# EasyEDA Pro project Keithley 2000 SCAN Panasonic DB25 V1.0.epro

# Schematic Keithley 2000 SCAN Panasonic DB25 V1.0
Board Name: Keithley 2000 SCAN Panasonic DB25 V1.0; Create Date: 2026-03-20; Page Name: Main; Project Name: SCAN2000; Schematic Name: Keithley 2000 SCAN Panasonic DB25 V1.0; Update Date: 2026-03-20; Company: EasyEDA.com; Page Size: A4; Version: V1.0
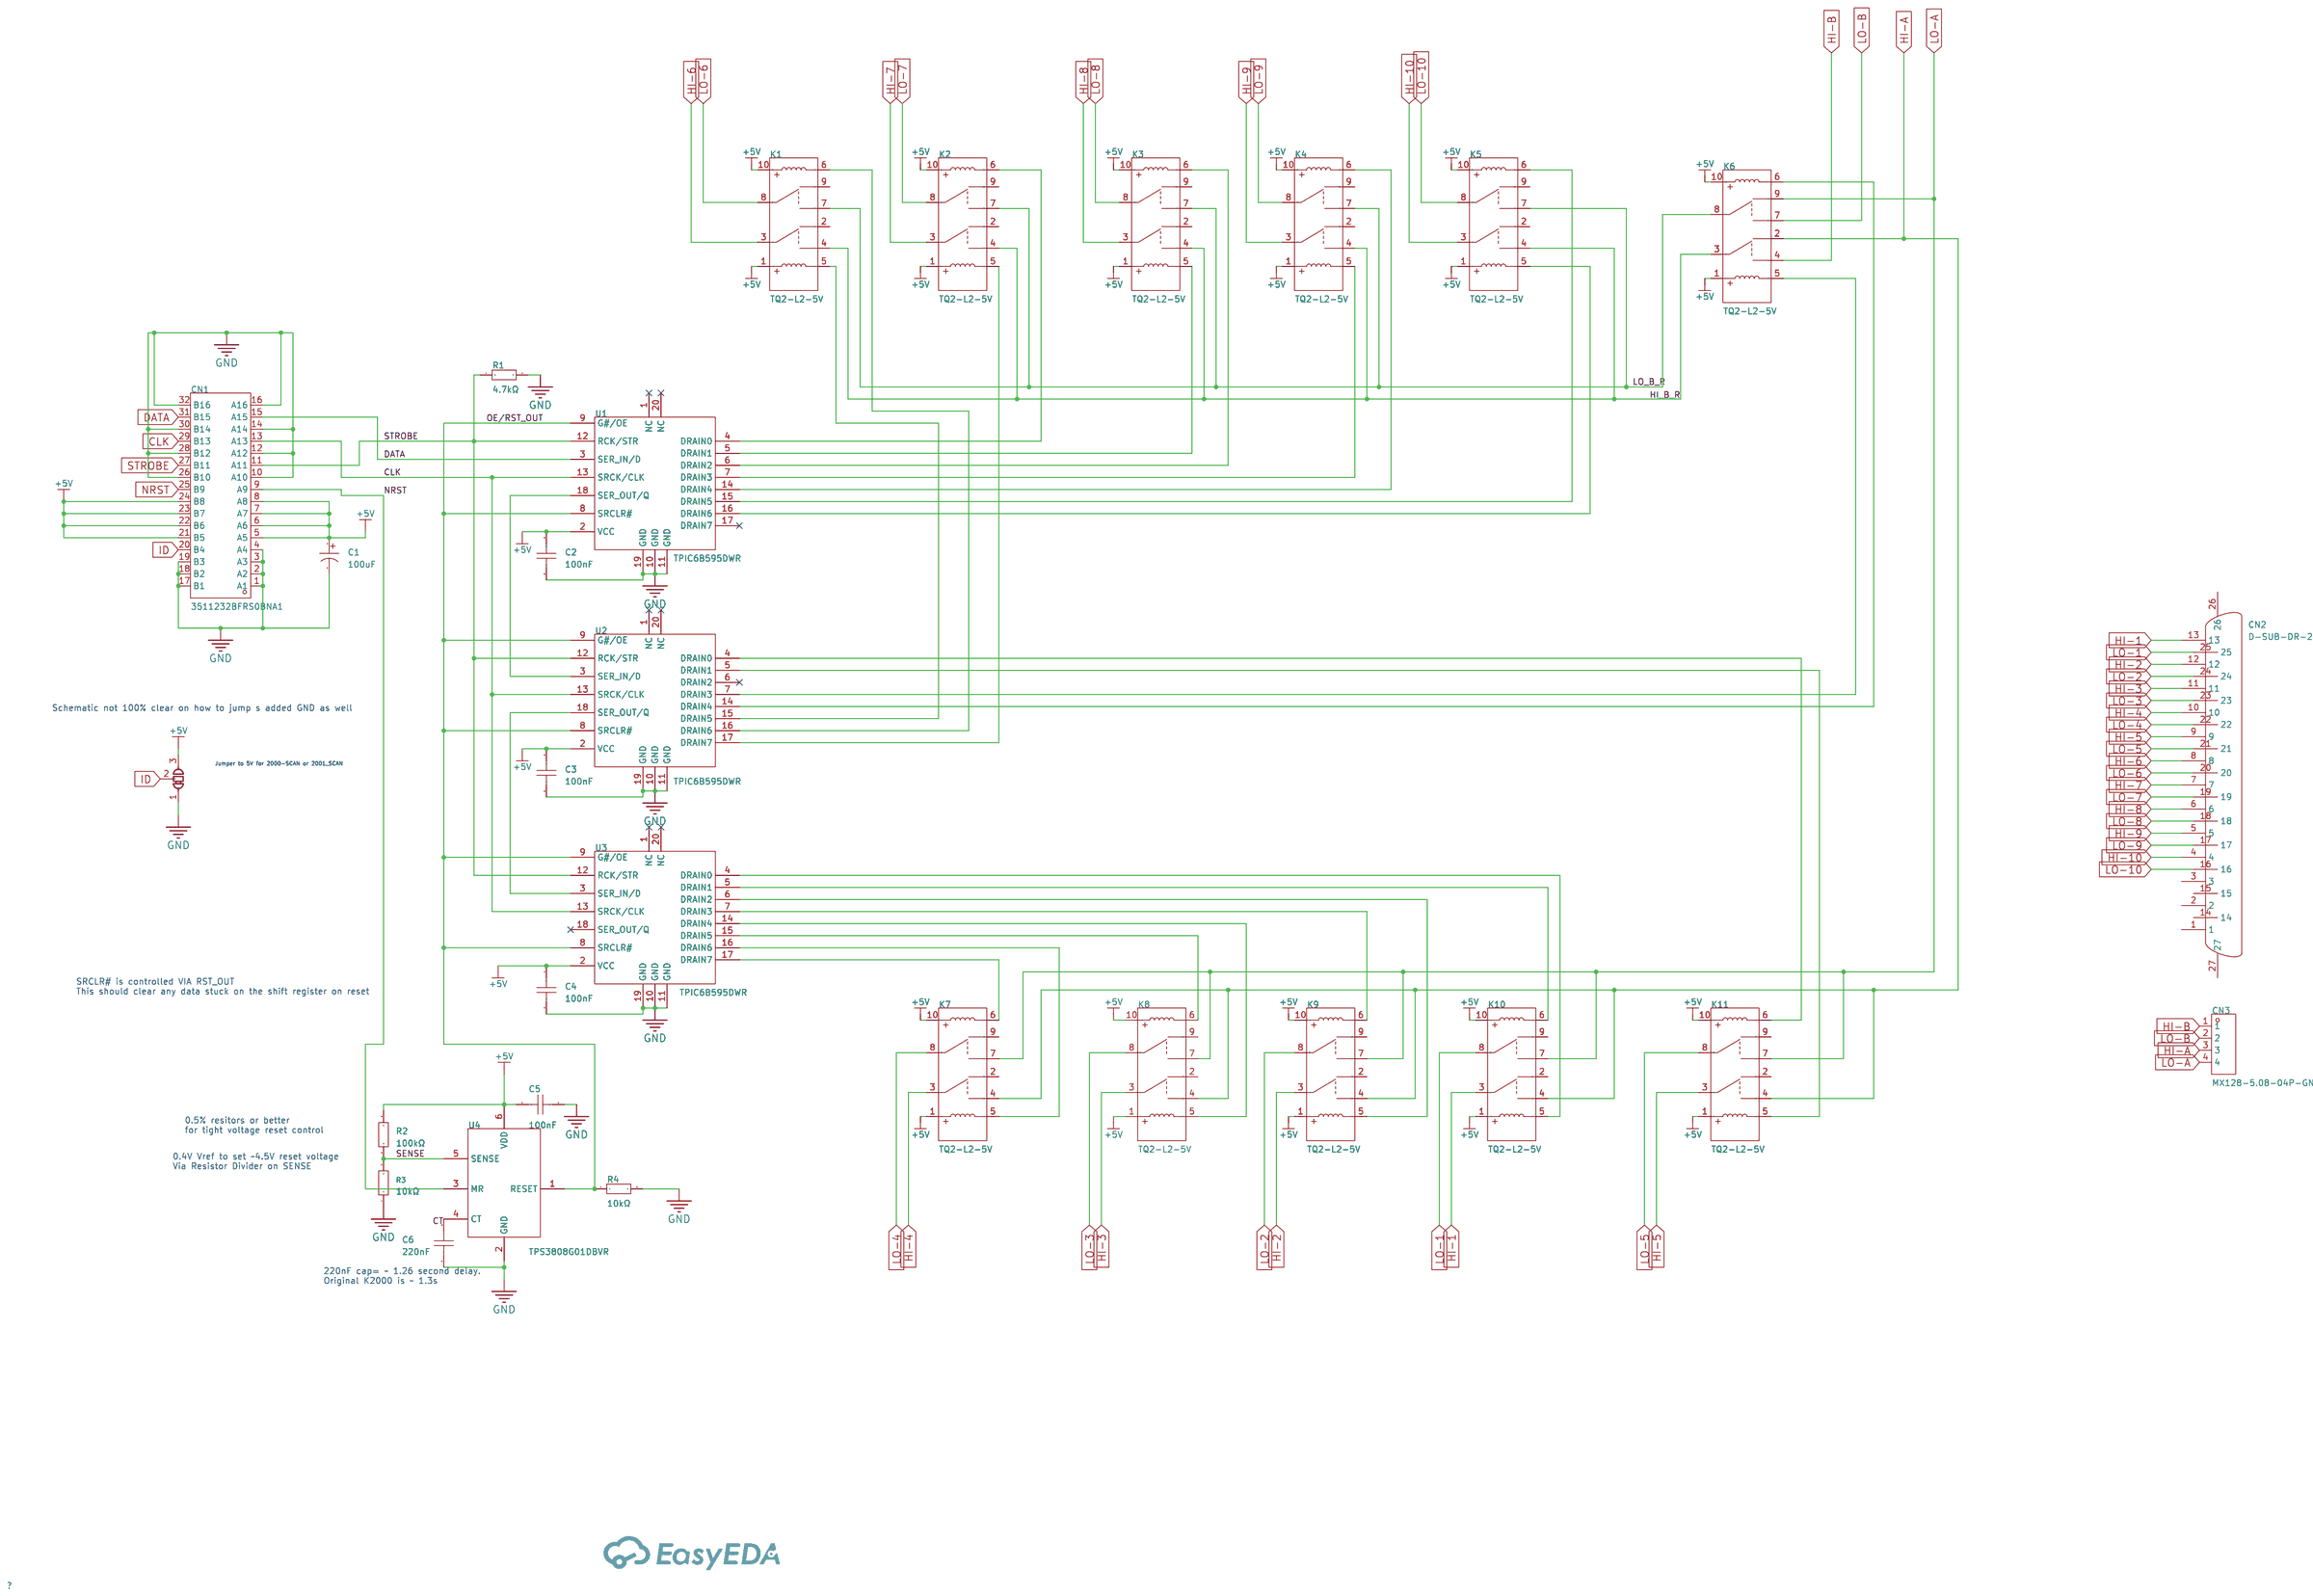
[diagram p0: schematic sheet]

## Parts
C1  100uF  [CAP-TH_BD8.0-P3.50-D0.6-FD]
C2  100nF  [C0603]
C3  100nF  [C0603]
C4  100nF  [C0603]
C5  100nF  [C0603]
C6  220nF  [C0603]
CN1  3511232BFRS0BNA1  [CONN-TH_3511232BFRS0BNA1]
CN2  D-SUB-DR-25PCG-BB  [DB25-TH_D-SUB-DR-25PCG-BB]
CN3  MX128-5.08-04P-GN01-Cu-Y-A  [CONN-TH_4P-P5.08_MX128-5.08-04P-GN01-CU-Y-A]
JP1  SolderJumper_3_Bridged12  [Jumper:SolderJumper-3_P1.3mm_Bridged12_Pad1.0x1.5mm_NumberLabels]
K1  TQ2-L2-5V  [RELAY-TH_TQ2-L2-XXV]
K2  TQ2-L2-5V  [RELAY-TH_TQ2-L2-XXV]
K3  TQ2-L2-5V  [RELAY-TH_TQ2-L2-XXV]
K4  TQ2-L2-5V  [RELAY-TH_TQ2-L2-XXV]
K5  TQ2-L2-5V  [RELAY-TH_TQ2-L2-XXV]
K6  TQ2-L2-5V  [RELAY-TH_TQ2-L2-XXV]
K7  TQ2-L2-5V  [RELAY-TH_TQ2-L2-XXV]
K8  TQ2-L2-5V  [RELAY-TH_TQ2-L2-XXV]
K9  TQ2-L2-5V  [RELAY-TH_TQ2-L2-XXV]
K10  TQ2-L2-5V  [RELAY-TH_TQ2-L2-XXV]
K11  TQ2-L2-5V  [RELAY-TH_TQ2-L2-XXV]
R1  4.7kΩ  [R0603]
R2  100kΩ  [R0603]
R3  10kΩ  [R0603]
R4  10kΩ  [R0603]
U1  TPIC6B595DWR  [SOIC-20_L13.0-W7.6-P1.27-LS10.3-BL]
U2  TPIC6B595DWR  [SOIC-20_L13.0-W7.6-P1.27-LS10.3-BL]
U3  TPIC6B595DWR  [SOIC-20_L13.0-W7.6-P1.27-LS10.3-BL]
U4  TPS3808G01DBVR  [SOT-23-6_L2.9-W1.6-P0.95-LS2.8-BR]

## Library data of the parts
C1 = ERJ1HM101F12OT: Capacitance:100uF Tolerance:±20% Tolerance:±20% Voltage Rating:50V Ripple Current:950mA@100kHz Equivalent Series Resistance(ESR):120mΩ@100kHz Pin Spacing:3.5mm Diameter:8mm Height - Seated (Max):12mm Lifetime:10000hrs@105℃; LCSC Part Name: 100uF ±20% 50V; Supplier Part: C106559; Manufacturer: AISHI(艾华集团); Supplier Footprint: 插件,D8xL12mm; Datasheet: https://item.szlcsc.com/datasheet/ERJ1HM101F12OT/107775.html; Supplier: LCSC; Tolerance: ±20%; Voltage Rating: 50V; Ripple Current: 950mA@100kHz; Equivalent Series Resistance(ESR): 120mΩ@100kHz; Pin Spacing: 3.5mm; Diameter: 8mm; Height - Seated (Max): 12mm; Lifetime: 10000hrs@105℃
C2-C5 = CL10B104KB8NNNC: Capacitance:100nF Tolerance:±10% Tolerance:±10% Voltage Rating:50V Temperature Coefficient:X7R; LCSC Part Name: 100nF ±10% 50V; Supplier Part: C1591; Manufacturer: SAMSUNG(三星); Supplier Footprint: 0603; JLCPCB Part Class: Extended Part; Datasheet: https://item.szlcsc.com/datasheet/CL10B104KB8NNNC/1943.html; Supplier: LCSC; Tolerance: ±10%; Voltage Rating: 50V; Temperature Coefficient: X7R
C6 = CL10B224KA8NNNC: Capacitance:220nF Tolerance:±10% Tolerance:±10% Voltage Rating:25V Temperature Coefficient:X7R; LCSC Part Name: 220nF ±10% 25V; Supplier Part: C21120; Manufacturer: SAMSUNG(三星); Supplier Footprint: 0603; JLCPCB Part Class: Basic Part; Datasheet: https://item.szlcsc.com/datasheet/CL10B224KA8NNNC/21832.html; Supplier: LCSC; Tolerance: ±10%; Voltage Rating: 25V; Temperature Coefficient: X7R
CN1 = 3511232BFRS0BNA1: Number of Pins:32P Pitch:2.54mm Mounting Type:Right Angle Number of Rows:2 Current Rating:3A Contact Material:Brass Contact Plating:Gold Operating Temperature:-40℃~+105℃ Operating Temperature:-40℃~+105℃; LCSC Part Name: PIN:32P 间距:2.54mm 弯插; Supplier Part: C963692; Manufacturer: JILN(锦凌); Supplier Footprint: 弯插,P=2.54mm; Datasheet: https://item.szlcsc.com/datasheet/3511232BFRS0BNA1/1048125.html; Supplier: LCSC; Number of Pins: 32P; Pitch: 2.54mm; Mounting Type: Right Angle; Number of Rows: 2; Current Rating: 3A; Contact Material: Brass; Contact Plating: Gold; Operating Temperature: -40℃~+105℃
CN2 = D-SUB-DR-25PCG-BB: Gender:Male Number of Pins:25P Mounting Type:Right Angle Number of Rows:2 Current Rating-Signal:3A Color:Black Operating Temperature:-55℃~+105℃ Operating Temperature:-55℃~+105℃; LCSC Part Name: 公 P数:25P; Supplier Part: C19077345; Manufacturer: XUNPU(讯普); Supplier Footprint: 弯插; Datasheet: https://item.szlcsc.com/datasheet/D-SUB-DR-25PCG-BB/20275089.html; Supplier: LCSC; Gender: Male; Number of Pins: 25P; Mounting Type: Right Angle; Number of Rows: 2; Current Rating-Signal: 3A; Color: Black; Operating Temperature: -55℃~+105℃
CN3 = MX128-5.08-04P-GN01-Cu-Y-A: Number of Positions or Pins:1x4P Pitch:5.08mm Color:Green Mounting Type:Through Hole Number of Pins:4P Number of Rows:1 Number of PINs Per Row:4 Screw Specification:M2.5 Current Rating:10A Voltage Rating (Max):300V Wire Gauge - AWG:12~24 Operating Tempera; LCSC Part Name: 1x4P 5.08mm 直插 排数:1 每排P数:4; Supplier Part: C5290377; Manufacturer: MAX(迈旭); Supplier Footprint: 插件,P=5.08mm; Datasheet: https://item.szlcsc.com/datasheet/MX128-5.08-04P-GN01-Cu-Y-A/6031580.html; Supplier: LCSC; Number of Positions or Pins: 1x4P; Pitch: 5.08mm; Color: Green; Mounting Type: Through Hole; Number of Pins: 4P; Number of Rows: 1; Number of PINs Per Row: 4; Screw Specification: M2.5; Current Rating: 10A; Voltage Rating (Max): 300V; Wire Gauge - AWG: 12~24; Operating Temperature: -40℃~+105℃
JP1 = Jumper_SolderJumper_3_Bridged12: 3-pole Solder Jumper, pins 1+2 closed/bridged; Attribute1: 1; Attribute2: 3; DNP: 1
K1-K11 = TQ2-L2-5V: Coil Voltage:5V Contact Form:2 Form C: 2C (DPDT-CO) Number of Pins:- Contact Rating:- Switching Voltage(Max):125V@AC；110V@DC Coil Type:Dual Coil Contact Material:Silver + Gold Plated Coil Rated Power:- Coil Resistance:- Switching Current(Max):1A Operate T; Supplier Part: C1525303; Manufacturer: PANASONIC(松下); Supplier Footprint: DIP,14x9mm; JLCPCB Part Class: Extended Part; Datasheet: https://item.szlcsc.com/datasheet/TQ2-L2-5V/1616102.html; Supplier: LCSC; Coil Voltage: 5V; Contact Form: 2 Form C: 2C (DPDT-CO); Switching Voltage(Max): 125V@AC；110V@DC; Coil Type: Dual Coil; Contact Material: Silver + Gold Plated; Switching Current(Max): 1A; Operate Time: 3ms; Release Time: 3ms; Operating Temperature: -40℃~+70℃
R1 = RC0603FR-074K7L: Type:Thick Film Resistor Resistance:4.7kΩ Tolerance:±1% Tolerance:±1% Power(Watts):100mW Voltage-Supply(Max):75V Temperature Coefficient:±100ppm/℃ Temperature Coefficient:±100ppm/℃ Operating Temperature:-55℃~+155℃ Operating Temperature:-55℃~+155℃; LCSC Part Name: 厚膜电阻 4.7kΩ ±1% 100mW; Supplier Part: C99782; Manufacturer: YAGEO(国巨); Supplier Footprint: 0603; JLCPCB Part Class: Extended Part; Datasheet: https://item.szlcsc.com/datasheet/RC0603FR-074K7L/100996.html; Supplier: LCSC; Type: Thick Film Resistor; Tolerance: ±1%; Power(Watts): 100mW; Voltage-Supply(Max): 75V; Temperature Coefficient: ±100ppm/℃; Operating Temperature: -55℃~+155℃
R2 = AR03DTCX1003: Type:Thin Film Resistor Resistance:100kΩ Tolerance:±0.5% Tolerance:±0.5% Power(Watts):100mW Voltage-Supply(Max):75V Temperature Coefficient:±25ppm/℃ Temperature Coefficient:±25ppm/℃ Operating Temperature:-55℃~+155℃ Operating Temperature:-55℃~+155℃; LCSC Part Name: 薄膜电阻 100kΩ ±0.5% 100mW; Supplier Part: C319967; Manufacturer: Viking(光颉); Supplier Footprint: 0603; Datasheet: https://item.szlcsc.com/datasheet/AR03DTCX1003/301037.html; Supplier: LCSC; Type: Thin Film Resistor; Tolerance: ±0.5%; Power(Watts): 100mW; Voltage-Supply(Max): 75V; Temperature Coefficient: ±25ppm/℃; Operating Temperature: -55℃~+155℃
R3 = 0603WAD1002T5E: Type:Thick Film Resistor Resistance:10kΩ Tolerance:±0.5% Tolerance:±0.5% Power(Watts):100mW Voltage-Supply(Max):75V Temperature Coefficient:±100ppm/℃ Temperature Coefficient:±100ppm/℃ Operating Temperature:-55℃~+155℃ Operating Temperature:-55℃~+155℃; LCSC Part Name: 10kΩ ±0.5% 100mW 厚膜电阻; Supplier Part: C167144; Manufacturer: UNI-ROYAL(厚声); Supplier Footprint: 0603; JLCPCB Part Class: Extended Part; Datasheet: https://item.szlcsc.com/datasheet/0603WAD1002T5E/178527.html; Supplier: LCSC; Type: Thick Film Resistor; Tolerance: ±0.5%; Power(Watts): 100mW; Voltage-Supply(Max): 75V; Temperature Coefficient: ±100ppm/℃; Operating Temperature: -55℃~+155℃
R4 = RC0603FR-0710KL: Type:Thick Film Resistors Resistance: Tolerance:±1% Tolerance:±1% Power(Watts): Overload Voltage (Max): Temperature Coefficient:±100ppm/℃ Temperature Coefficient:±100ppm/℃ Operating Temperature Range:-55℃~+155℃ Operating Temperature Range:-55℃~+155℃; LCSC Part Name: 厚膜电阻 10kΩ ±1% 100mW; Supplier Part: C98220; Manufacturer: YAGEO(国巨); Supplier Footprint: 0603; JLCPCB Part Class: Extended Part; Datasheet: https://atta.szlcsc.com/upload/public/pdf/source/20180927/C295883_E8D83085EA81BD7DE0B2B681138C15EE.pdf; Supplier: LCSC; Type: Thick Film Resistors; Tolerance: ±1%; Temperature Coefficient: ±100ppm/℃; Operating Temperature Range: -55℃~+155℃
U1-U3 = TPIC6B595DWR: Function:Serial-to-Serial or Parallel Voltage - Supply:4.5V~5.5V Voltage - Supply:4.5V~5.5V Clock Frequency:- Number of Elements:1 Number of Bits per Element:- Output Type:Open Drain Series:TPIC Operating Temperature:-40℃~+125℃ Operating Temperature:-40℃~; LCSC Part Name: 开路漏极输出 8位串行至串行或并行移位寄存器; Supplier Part: C7094; Manufacturer: TI(德州仪器); Supplier Footprint: SOIC-20-300mil; JLCPCB Part Class: Extended Part; Datasheet: https://www.ti.com/cn/lit/gpn/tpic6b595; Supplier: LCSC; Function: Serial-to-Serial or Parallel; Voltage - Supply: 4.5V~5.5V; Number of Elements: 1; Output Type: Open Drain; Series: TPIC; Operating Temperature: -40℃~+125℃
U4 = TPS3808G01DBVR: ChipType:Voltage monitor Output Type:Open Drain Voltage - Supply:1.7V~6.5V Voltage - Supply:1.7V~6.5V Reset Active Level:Active Low Threshold Voltage:405mV Number of Voltages Monitored:1 Manual Reset:Yes Watchdog:No Reset Timeout:20us Operating Temperatur; LCSC Part Name: 低静态电流可编程延迟监控电路; Supplier Part: C19653; Manufacturer: TI(德州仪器); Supplier Footprint: SOT-23-6; JLCPCB Part Class: Extended Part; Datasheet: https://www.ti.com/cn/lit/gpn/tps3808; Supplier: LCSC; ChipType: Voltage monitor; Output Type: Open Drain; Voltage - Supply: 1.7V~6.5V; Reset Active Level: Active Low; Threshold Voltage: 405mV; Number of Voltages Monitored: 1; Manual Reset: Yes; Watchdog: No; Reset Timeout: 20us; Operating Temperature: -40℃~+125℃@(Tj)

## Nets
+5V: C1.1 C2.1 C3.1 C4.1 C5.2 CN1.5(A5) CN1.6(A6) CN1.7(A7) CN1.8(A8) CN1.21(B5) CN1.22(B6) CN1.23(B7) CN1.24(B8) JP1.3(B) K1.1 K1.10(6) K2.1 K2.10(6) K3.1 K3.10(6) K4.1 K4.10(6) K5.1 K5.10(6) K6.1 K6.10(6) K7.1 K7.10(6) K8.1 K8.10(6) K9.1 K9.10(6) K10.1 K10.10(6) K11.1 K11.10(6) R2.2 U1.2(VCC) U2.2(VCC) U3.2(VCC) U4.6(VDD)
GND: C1.2 C2.2 C3.2 C4.2 C5.1 C6.2 CN1.1(A1) CN1.2(A2) CN1.3(A3) CN1.4(A4) CN1.10(A10) CN1.12(A12) CN1.14(A14) CN1.16(A16) CN1.17(B1) CN1.18(B2) CN1.19(B3) CN1.26(B10) CN1.28(B12) CN1.30(B14) CN1.32(B16) JP1.1(A) R1.2 R3.1 R4.2 U1.10(GND) U1.11(GND) U1.19(GND) U2.10(GND) U2.11(GND) U2.19(GND) U3.10(GND) U3.11(GND) U3.19(GND) U4.2(GND)
CLK: CN1.13(A13) CN1.29(B13) U1.13(SRCK/CLK) U2.13(SRCK/CLK) U3.13(SRCK/CLK)
CT: C6.1 U4.4(CT)
DATA: CN1.15(A15) CN1.31(B15) U1.3(SER IN/D)
HI-1: CN2.13 K10.3(4)
HI-2: CN2.12 K9.3(4)
HI-3: CN2.11 K8.3(4)
HI-4: CN2.10 K7.3(4)
HI-5: CN2.9 K11.3(4)
HI-6: CN2.8 K1.3(4)
HI-7: CN2.7 K2.3(4)
HI-8: CN2.6 K3.3(4)
HI-9: CN2.5 K4.3(4)
HI-10: CN2.4 K5.3(4)
HI-A: CN3.3 K6.2(3) K7.4(5) K8.4(5) K9.4(5) K10.4(5) K11.4(5)
HI-B: CN3.1 K6.4(5)
HI_B_R: K1.4(5) K2.4(5) K3.4(5) K4.4(5) K5.4(5) K6.3(4)
ID: CN1.20(B4) JP1.2(C)
LO-1: CN2.25 K10.8(9)
LO-2: CN2.24 K9.8(9)
LO-3: CN2.23 K8.8(9)
LO-4: CN2.22 K7.8(9)
LO-5: CN2.21 K11.8(9)
LO-6: CN2.20 K1.8(9)
LO-7: CN2.19 K2.8(9)
LO-8: CN2.18 K3.8(9)
LO-9: CN2.17 K4.8(9)
LO-10: CN2.16 K5.8(9)
LO-A: CN3.4 K6.9(10) K7.7(8) K8.7(8) K9.7(8) K10.7(8) K11.7(8)
LO-B: CN3.2 K6.7(8)
LO_B_R: K1.7(8) K2.7(8) K3.7(8) K4.7(8) K5.7(8) K6.8(9)
NRST: CN1.9(A9) CN1.25(B9) U4.3(MR)
OE/RST_OUT: R4.1 U1.8(SRCLR#) U1.9(G#/OE) U2.8(SRCLR#) U2.9(G#/OE) U3.8(SRCLR#) U3.9(G#/OE) U4.1(RESET)
SENSE: R2.1 R3.2 U4.5(SENSE)
STROBE: CN1.11(A11) CN1.27(B11) R1.1 U1.12(RCK/STR) U2.12(RCK/STR) U3.12(RCK/STR)
$K1_5: K1.5(12) U2.15(DRAIN5)
$K1_6: K1.6(7) U2.16(DRAIN6)
$K2_5: K2.5(12) U2.17(DRAIN7)
$K2_6: K2.6(7) U1.4(DRAIN0)
$K3_5: K3.5(12) U1.5(DRAIN1)
$K3_6: K3.6(7) U1.6(DRAIN2)
$K4_5: K4.5(12) U1.7(DRAIN3)
$K4_6: K4.6(7) U1.14(DRAIN4)
$K5_5: K5.5(12) U1.16(DRAIN6)
$K5_6: K5.6(7) U1.15(DRAIN5)
$K6_5: K6.5(12) U2.7(DRAIN3)
$K6_6: K6.6(7) U2.14(DRAIN4)
$K7_5: K7.5(12) U3.16(DRAIN6)
$K7_6: K7.6(7) U3.17(DRAIN7)
$K8_5: K8.5(12) U3.14(DRAIN4)
$K8_6: K8.6(7) U3.15(DRAIN5)
$K9_5: K9.5(12) U3.6(DRAIN2)
$K9_6: K9.6(7) U3.7(DRAIN3)
$K10_5: K10.5(12) U3.4(DRAIN0)
$K10_6: K10.6(7) U3.5(DRAIN1)
$K11_5: K11.5(12) U2.5(DRAIN1)
$K11_6: K11.6(7) U2.4(DRAIN0)
$U1_18: U1.18(SER OUT/Q) U2.3(SER IN/D)
$U2_18: U2.18(SER OUT/Q) U3.3(SER IN/D)

Not connected (* = marked no-connect by the designer): CN2 1 2 3 14 15 26 27; K1 2(3) 9(10); K2 2(3) 9(10); K3 2(3) 9(10); K4 2(3) 9(10); K5 2(3) 9(10); K7 2(3) 9(10); K8 2(3) 9(10); K9 2(3) 9(10); K10 2(3) 9(10); K11 2(3) 9(10); U1 1(NC)* 17(DRAIN7)* 20(NC)*; U2 1(NC)* 6(DRAIN2)* 20(NC)*; U3 1(NC)* 18(SER OUT/Q)* 20(NC)*

## Notes on the sheet
- Schematic not 100% clear on how to jump s added GND as well
- Jumper to 5V for 2000-SCAN or 2001_SCAN
- SRCLR# is controlled VIA RST_OUT
  This should clear any data stuck on the shift register on reset
- 0.5% resitors or better
  for tight voltage reset control
- 0.4V Vref to set ~4.5V reset voltage
  Via Resistor Divider on SENSE
- 220nF cap= ~ 1.26 second delay.
  Original K2000 is ~ 1.3s

# Board Keithley 2000 SCAN Panasonic DB25 V1.0
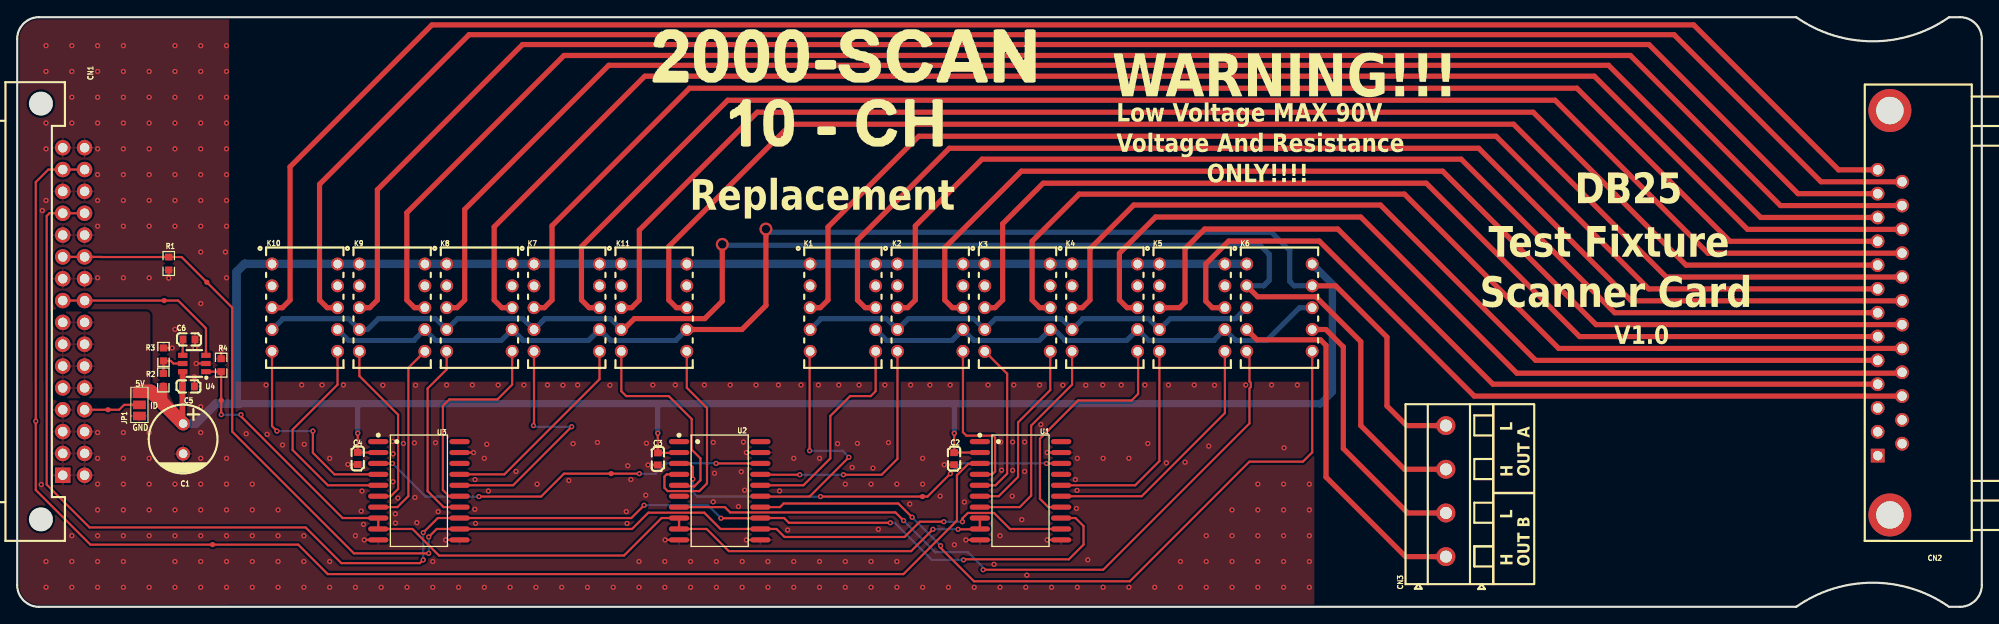
[diagram p1: board, top side]
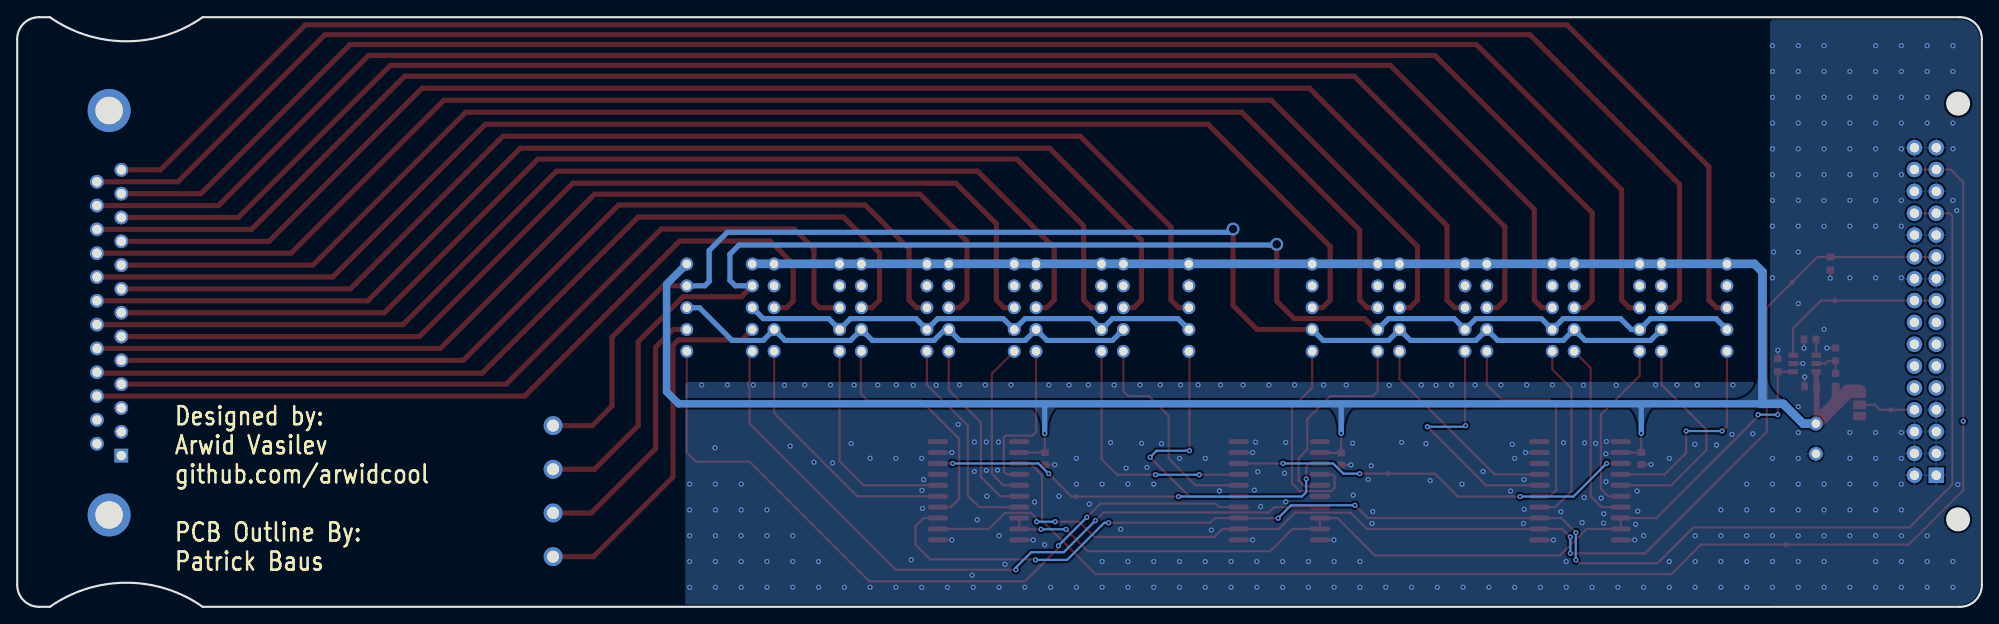
[diagram p2: board, bottom side, seen from below]

Outline 228.6 x 68.58 mm; copper layers: Top Layer, Bottom Layer. Coordinates in mm from the lower left corner of the outline.
Outline path: 0,66.04 arc(0.74,67.84) 2.54,68.58 207.01,68.58 arc(215.9,65.78) 224.79,68.58 226.06,68.58 arc(227.86,67.84) 228.6,66.04 228.6,2.54 arc(227.86,0.74) 226.06,0 224.79,0 arc(215.9,2.8) 207.01,0 2.54,0 arc(0.74,0.74) 0,2.54 0,66.04
Stack: Top Layer 0.035mm / Dielectric1 1.51mm FR4 er 4.5 / Bottom Layer 0.035mm

## Design rules (mm)
template: JLCPCB Capability(Two Layers Board)
spacing copperThickness1oz (default): track to track 0.102, other pairs 0.152 to 0.3
spacing copperThickness2oz: track to track 0.203, other pairs 0.152 to 0.3
track width copperThickness1oz (default): min 0.127, default 0.254, max 2.54
track width copperThickness2oz: min 0.203, default 0.254, max 2.54
differential pair differentialPair (default): width min 0.127, default 0.254, max 2.54; gap min 0.152, default 0.152
via viaSize (default): diameter min 0.5, default 0.61, max 10; hole min 0.3, default 0.305, max 6.3

## Placement (name value [footprint] x y rotation side)
C1  100uF  [CAP-TH_BD8.0-P3.50-D0.6-FD]  19.31 19.55 270 top
C2  100nF  [C0603]  109.02 17.23 270 top
C3  100nF  [C0603]  74.55 17.2 270 top
C4  100nF  [C0603]  39.62 17.26 270 top
C5  100nF  [C0603]  19.93 25.63 180 top
C6  220nF  [C0603]  19.99 31.11 0 top
CN1  3511232BFRS0BNA1  [CONN-TH_3511232BFRS0BNA1]  6.57 34.35 270 top
CN2  D-SUB-DR-25PCG-BB  [DB25-TH_D-SUB-DR-25PCG-BB]  217.9 34.2 90 top
CN3  MX128-5.08-04P-GN01-Cu-Y-A  [CONN-TH_4P-P5.08_MX128-5.08-04P-GN01-CU-Y-A]  166.24 13.46 90 top
JP1  SolderJumper_3_Bridged12  [Jumper:SolderJumper-3_P1.3mm_Bridged12_Pad1.0x1.5mm_NumberLabels]  14.22 23.49 90 top
K1  TQ2-L2-5V  [RELAY-TH_TQ2-L2-XXV]  96.08 34.79 270 top
K2  TQ2-L2-5V  [RELAY-TH_TQ2-L2-XXV]  106.24 34.79 270 top
K3  TQ2-L2-5V  [RELAY-TH_TQ2-L2-XXV]  116.4 34.79 270 top
K4  TQ2-L2-5V  [RELAY-TH_TQ2-L2-XXV]  126.56 34.79 270 top
K5  TQ2-L2-5V  [RELAY-TH_TQ2-L2-XXV]  136.72 34.79 270 top
K6  TQ2-L2-5V  [RELAY-TH_TQ2-L2-XXV]  146.88 34.79 270 top
K7  TQ2-L2-5V  [RELAY-TH_TQ2-L2-XXV]  63.95 34.79 270 top
K8  TQ2-L2-5V  [RELAY-TH_TQ2-L2-XXV]  53.79 34.79 270 top
K9  TQ2-L2-5V  [RELAY-TH_TQ2-L2-XXV]  43.63 34.79 270 top
K10  TQ2-L2-5V  [RELAY-TH_TQ2-L2-XXV]  33.47 34.79 270 top
K11  TQ2-L2-5V  [RELAY-TH_TQ2-L2-XXV]  74.11 34.79 270 top
NOREF  -  [Pad_e19987]  22.06 37.75 0 top
NOREF#2  -  [Pad_e19999]  23.74 24.01 0 top
NOREF#3  -  [Pad_e19993]  10.57 22.92 0 top
NOREF#4  -  [Pad_e20005]  22.74 7.23 0 top
NOREF#5  -  [Pad_e19981]  17.1 35.62 0 top
NOREF#6  -  [Pad_e20018]  69.11 15.49 0 top
NOREF#7  -  [Pad_e20012]  105.34 12.82 0 top
R1  4.7kΩ  [R0603]  17.63 39.93 270 top
R2  100kΩ  [R0603]  17.01 26.39 270 top
R3  10kΩ  [R0603]  17.03 29.36 270 top
R4  10kΩ  [R0603]  23.74 28.1 90 top
U1  TPIC6B595DWR  [SOIC-20_L13.0-W7.6-P1.27-LS10.3-BL]  116.74 13.5 270 top
U2  TPIC6B595DWR  [SOIC-20_L13.0-W7.6-P1.27-LS10.3-BL]  81.74 13.5 270 top
U3  TPIC6B595DWR  [SOIC-20_L13.0-W7.6-P1.27-LS10.3-BL]  46.74 13.5 270 top
U4  TPS3808G01DBVR  [SOT-23-6_L2.9-W1.6-P0.95-LS2.8-BR]  20.61 28.3 0 top

## Footprints (pads in the part's own frame, mm; a bottom-side part is the same pattern mirrored in y, then rotated)
C0603
  rect 0.8x0.9 smd: 1(-0.7,0) 2(0.7,0)
CAP-TH_BD8.0-P3.50-D0.6-FD
  round 1.6 hole 1: 1(-1.75,0) 2(1.75,0)
CONN-TH_4P-P5.08_MX128-5.08-04P-GN01-CU-Y-A
  round 2.2 hole 1.4: 1(-7.62,0) 2(-2.54,0) 3(2.54,0) 4(7.62,0)
CONN-TH_3511232BFRS0BNA1
  rect 1.8x1.8 hole 1.1: 1(19.05,-1.27)
  round 1.8 hole 1.1: 2(16.51,-1.27) 3(13.97,-1.27) 4(11.43,-1.27) 5(8.89,-1.27) 6(6.35,-1.27) 7(3.81,-1.27) 8(1.27,-1.27) 9(-1.27,-1.27) 10(-3.81,-1.27) 11(-6.35,-1.27) 12(-8.89,-1.27) 13(-11.43,-1.27) 14(-13.97,-1.27) 15(-16.51,-1.27) 16(-19.05,-1.27) 17(19.05,1.27) 18(16.51,1.27) 19(13.97,1.27) 20(11.43,1.27) 21(8.89,1.27) 22(6.35,1.27) 23(3.81,1.27) 24(1.27,1.27) 25(-1.27,1.27) 26(-3.81,1.27) 27(-6.35,1.27) 28(-8.89,1.27) 29(-11.43,1.27) 30(-13.97,1.27) 31(-16.51,1.27) 32(-19.05,1.27)
DB25-TH_D-SUB-DR-25PCG-BB
  rect 1.6x1.6 hole 1.1: 1(-16.62,1.42)
  round 1.6 hole 1.1: 2(-13.85,1.42) 3(-11.08,1.42) 4(-8.31,1.42) 5(-5.54,1.42) 6(-2.77,1.42) 7(0,1.42) 8(2.77,1.42) 9(5.54,1.42) 10(8.31,1.42) 11(11.08,1.42) 12(13.85,1.42) 13(16.62,1.42) 14(-15.235,-1.42) 15(-12.465,-1.42) 16(-9.695,-1.42) 17(-6.925,-1.42) 18(-4.155,-1.42) 19(-1.385,-1.42) 20(1.385,-1.42) 21(4.155,-1.42) 22(6.925,-1.42) 23(9.695,-1.42) 24(12.465,-1.42) 25(15.235,-1.42)
  round 5 hole 3.2: 26(23.52,0) 27(-23.52,0)
Jumper:SolderJumper-3_P1.3mm_Bridged12_Pad1.0x1.5mm_NumberLabels
  rect 1x1.5 smd: 1(-1.3,0) 2(0,0) 3(1.3,0)
Pad_e19981
  round 0.61 smd: TP1(0,0)
Pad_e19987
  round 0.61 smd: TP2(0,0)
Pad_e19993
  round 0.61 smd: TP3(0,0)
Pad_e19999
  round 0.61 smd: TP4(0,0)
Pad_e20005
  round 0.61 smd: TP5(0,0)
Pad_e20012
  round 0.61 smd: TP6(0,0)
Pad_e20018
  round 0.61 smd: TP7(0,0)
R0603
  rect 0.806x0.864 smd: 1(-0.753,0) 2(0.753,0)
RELAY-TH_TQ2-L2-XXV
  round 1.5 hole 1: 1(-5.08,-3.81) 2(-2.54,-3.81) 3(0,-3.81) 4(2.54,-3.81) 5(5.08,-3.81) 6(5.08,3.81) 7(2.54,3.81) 8(0,3.81) 9(-2.54,3.81) 10(-5.08,3.81)
SOIC-20_L13.0-W7.6-P1.27-LS10.3-BL
  oval 0.595x2.36 smd: 1(-5.715,-4.73) 2(-4.445,-4.73) 3(-3.175,-4.73) 4(-1.905,-4.73) 5(-0.635,-4.73) 6(0.635,-4.73) 7(1.905,-4.73) 8(3.175,-4.73) 9(4.445,-4.73) 10(5.715,-4.73) 11(5.715,4.73) 12(4.445,4.73) 13(3.175,4.73) 14(1.905,4.73) 15(0.635,4.73) 16(-0.635,4.73) 17(-1.905,4.73) 18(-3.175,4.73) 19(-4.445,4.73) 20(-5.715,4.73)
SOT-23-6_L2.9-W1.6-P0.95-LS2.8-BR
  rect 1.1x0.6 smd: 1(1.35,-0.95) 2(1.35,0) 3(1.35,0.95) 4(-1.35,0.95) 5(-1.35,0) 6(-1.35,-0.95)

## Nets
As in the schematic, except:
$U1_18: NOREF#7.TP6 U1.18 U2.3
$U2_18: NOREF#6.TP7 U2.18 U3.3
DATA: CN1.15 CN1.31 NOREF#4.TP5 U1.3
ID: CN1.20 JP1.2 NOREF#3.TP3
NRST: CN1.9 CN1.25 NOREF#5.TP1 U4.3
OE/RST_OUT: NOREF#2.TP4 R4.1 U1.8 U1.9 U2.8 U2.9 U3.8 U3.9 U4.1
STROBE: CN1.11 CN1.27 NOREF.TP2 R1.1 U1.12 U2.12 U3.12

Pads without a net: CN2 1 2 3 14 15 26 27; K1 2 9; K2 2 9; K3 2 9; K4 2 9; K5 2 9; K7 2 9; K8 2 9; K9 2 9; K10 2 9; K11 2 9; U1 1 17 20; U2 1 6 20; U3 1 18 20

## Via types
v1: diameter 0.61, hole 0.305, Top Layer to Bottom Layer, 378 vias
v2: diameter 1.5, hole 1, Top Layer to Bottom Layer, 2 vias

## Routing (per net, layer and track width the routed paths; a pad name or vN(x,y) marks a point on that pad's centre or on a via; arc(x,y) is an arc through that point)
+5V: length 323.9
  Top Layer w0.254: C2.1 109.03,17.94 ; 109.03,17.94 U1.2 ; 109.03,17.94 109.03,20.17 v1(109.04,20.18) ; v1(74.54,20.19) 74.54,17.91 C3.1 76.97,17.9 U2.2 ; v1(39.62,20.19) 39.62,17.9 39.67,17.94 U3.2
  Top Layer w0.61: 19.26,25.67 U4.6
  Top Layer w0.66: 19.23,21.38 C5.2
  Top Layer w0.914: 17.01,25.64 17.01,23.6
  Top Layer w1.575: 19.23,21.38 17.01,23.6 15.54,25.06 14.22,25.06
  Bottom Layer w0.61: v1(109.04,20.18) 109.04,23.48 108.93,23.59 ; v1(74.54,20.19) 74.54,23.59 ; v1(39.62,20.19) 39.62,23.59
  Bottom Layer w0.864: 25.78,23.62 151.64,23.62 153.04,25.01 153.04,37.52 K6.10
  Bottom Layer w1: 39.83,39.89 37.29,39.89 ; 39.83,39.89 K9.1 ; 39.83,39.89 143.05,39.89 K6.1 ; 37.29,39.89 29.67,39.89 K10.1 ; 37.29,39.89 K10.10 ; 25.4,23.62 25.78,23.62 ; 25.4,23.62 23.11,23.62 20.8,21.3 C1.1 ; 25.4,23.62 25.53,23.74 25.53,38.95 26.46,39.89 29.66,39.89
GND: length 24.2
  Top Layer w0.254: U3.10 v1(40.39,7.78) ; C2.2 v1(107.87,16.53) ; U1.19 v1(119.85,17.94) ; U3.19 v1(53.1,17.94) ; C5.1 20.63,26.66 ; U1.11 v1(119.85,7.78) ; U4.2 v1(20.83,28.3) ; R3.1 v1(18.04,30.11) ; 23.74,28.86 v1(23.74,29.84) ; C6.2 v1(20.69,30.09) ; U2.10 v1(75.39,7.78) ; R1.2 v1(17.63,38.22) ; U2.11 v1(84.85,7.78) ; U2.19 v1(84.85,17.94) ; U3.11 v1(49.85,7.78) ; 74.55,16.5 v1(73.41,16.5) ; U1.10 v1(110.39,7.78) ; C4.2 v1(38.48,16.56)
  vias: v1(2.79,14.22) v1(2.92,46.1) v1(3.36,65.27) v1(3.36,62.27) v1(3.36,56.27) v1(3.36,53.27) v1(3.36,47.27) v1(3.36,5.27) v1(3.36,2.27) v1(6.36,65.27) v1(6.36,62.27) v1(6.36,59.27) v1(6.36,56.27) v1(6.36,8.27) v1(6.36,5.27) v1(6.36,2.27) v1(9.36,65.27) v1(9.36,62.27) v1(9.36,59.27) v1(9.36,56.27) v1(9.36,53.27) v1(9.36,50.27) v1(9.36,47.27) v1(9.36,44.27) v1(9.36,38.27) v1(9.36,20.27) v1(9.36,17.27) v1(9.36,14.27) v1(9.36,11.27) v1(9.36,8.27) v1(9.36,5.27) v1(9.36,2.27) v1(12.36,65.27) v1(12.36,62.27) v1(12.36,59.27) v1(12.36,56.27) v1(12.36,53.27) v1(12.36,50.27) v1(12.36,47.27) v1(12.36,44.27) v1(12.36,38.27) v1(12.36,20.27) v1(12.36,17.27) v1(12.36,14.27) v1(12.36,11.27) v1(12.36,8.27) v1(12.36,5.27) v1(12.36,2.27) v1(15.36,62.27) v1(15.36,59.27) v1(15.36,56.27) v1(15.36,53.27) v1(15.36,50.27) v1(15.36,47.27) v1(15.36,44.27) v1(15.36,38.27) v1(15.36,20.27) v1(15.36,17.27) v1(15.36,14.27) v1(15.36,11.27) v1(15.36,8.27) v1(15.36,2.27) v1(18.36,65.27) v1(18.36,62.27) v1(18.36,59.27) v1(18.36,56.27) v1(18.36,53.27) v1(18.36,50.27) v1(18.36,47.27) v1(18.36,44.27) v1(18.36,32.27) v1(18.36,14.27) v1(18.36,11.27) v1(18.36,8.27) v1(18.36,5.27) v1(18.36,2.27) v1(20.61,26.75) v1(21.36,65.27) v1(21.36,62.27) v1(21.36,59.27) v1(21.36,56.27) v1(21.36,53.27) v1(21.36,50.27) v1(21.36,47.27) v1(21.36,44.27) v1(21.36,41.27) v1(21.36,35.27) v1(21.36,23.27) v1(21.36,20.27) v1(21.36,17.27) v1(21.36,14.27) v1(21.36,11.27) v1(21.36,8.27) v1(21.36,5.27) v1(21.36,2.27) v1(24.23,41.27) v1(24.36,65.27) v1(24.36,62.27) v1(24.36,59.27) v1(24.36,56.27) v1(24.36,53.27) v1(24.36,50.27) v1(24.36,47.27) v1(24.36,44.27) v1(24.36,38.27) v1(24.36,17.27) v1(24.36,14.27) v1(24.36,11.27) v1(24.36,8.27) v1(24.36,5.27) v1(24.36,2.27) v1(26.65,20.13) v1(27.36,14.27) v1(27.36,11.27) v1(27.36,8.27) v1(27.36,5.27) v1(27.36,2.27) v1(28.96,25.81) v1(29.08,20.06) v1(30.36,11.27) v1(30.36,8.27) v1(30.36,5.27) v1(30.36,2.27) v1(30.87,18.82) v1(33.1,25.81) v1(33.4,18.9) v1(33.36,8.27) v1(33.36,5.27) v1(33.36,2.27) v1(35.47,25.81) v1(36.36,17.27) v1(36.36,5.27) v1(36.36,2.27) v1(37.96,25.81) v1(39.36,8.27) v1(39.36,2.27) v1(40.03,11.13) v1(40.12,13.47) v1(40.29,9.59) v1(42.36,2.27) v1(42.55,25.78) v1(43.68,19.23) v1(43.74,17.8) v1(43.73,14.55) v1(43.99,10.82) v1(44.01,9.73) v1(44.3,12.65) v1(44.94,19) v1(45.36,2.27) v1(46.22,19.07) v1(46.28,12.72) v1(46.36,25.78) v1(46.5,9.79) v1(48.36,5.27) v1(48.36,2.27) v1(48.67,19.09) v1(48.98,11.07) v1(49.96,25.81) v1(51.36,2.27) v1(52.96,25.81) v1(53.25,11.34) v1(53.27,14.8) v1(53.33,9.7) v1(54.36,17.27) v1(54.36,2.27) v1(54.64,18.9) v1(54.83,13.47) v1(55.96,25.81) v1(57.36,2.27) v1(58.04,15.74) v1(58.96,25.81) v1(60.36,2.27) v1(60.49,14.27) v1(61.71,25.81) v1(63.36,2.27) v1(63.5,25.78) v1(64.19,14.69) v1(64.68,18.98) v1(65.21,25.81) v1(66.36,2.27) v1(67.51,19.12) v1(68.96,25.78) v1(69.36,2.27) v1(70.87,11.08) v1(71.04,16.41) v1(70.96,9.69) v1(71.4,14.81) v1(72.36,5.27) v1(72.36,2.27) v1(73.14,12.98) v1(73.22,19.02) v1(73.96,25.81) v1(75.36,5.27) v1(75.36,2.27) v1(76.58,25.81) v1(78.36,5.27) v1(78.36,2.27) v1(79.96,25.81) v1(80.99,19.12) v1(80.98,12.21) v1(81.14,15.54) v1(81.36,5.27) v1(81.36,2.27) v1(82.96,25.81) v1(83.92,11.66) v1(84.25,15.72) v1(84.36,5.27) v1(84.36,2.27) v1(84.51,19.16) v1(84.64,13.57) v1(85.96,25.81) v1(87.36,5.27) v1(87.36,2.27) v1(88.58,25.81) v1(88.71,13.47) v1(89.65,8.93) v1(90.36,17.27) v1(90.36,5.27) v1(90.36,2.27) v1(91.2,25.81) v1(93.23,25.81) v1(93.36,17.27) v1(93.36,5.27) v1(93.36,2.27) v1(95.46,18.97) v1(95.59,25.81) v1(96.36,14.27) v1(96.36,5.27) v1(96.36,2.27) v1(97.16,16.21) v1(97.76,19.01) v1(97.96,25.81) v1(99.36,14.27) v1(99.36,5.27) v1(99.36,2.27) v1(99.57,16.13) v1(100.2,9.02) v1(100.96,25.81) v1(101.38,19.1) v1(102.36,14.27) v1(102.36,5.27) v1(102.36,2.27) v1(103.85,11.96) v1(103.96,25.81) v1(105.36,17.27) v1(105.36,14.27) v1(105.36,2.27) v1(106.2,25.81) v1(107.39,12.87) v1(108.36,2.27) v1(108.56,25.81) v1(109.05,7.22) v1(110.22,12.18) v1(111.36,2.27) v1(112.96,25.81) v1(113.67,4.94) v1(114.43,19.17) v1(114.36,8.27) v1(114.36,2.27) v1(114.54,15.9) v1(115.83,19.17) v1(115.83,15.87) v1(115.78,12.87) v1(115.96,25.81) v1(116.89,10.13) v1(117.22,19.17) v1(117.22,15.74) v1(117.36,2.27) v1(117.48,3.68) v1(118.96,25.81) v1(119.1,21.22) v1(120.36,2.27) v1(121.67,25.78) v1(123.13,14.79) v1(123.32,13.54) v1(123.25,11.44) v1(123.36,17.27) v1(123.36,2.27) v1(124.33,25.78) v1(124.57,5.46) v1(126.31,25.81) v1(126.36,17.27) v1(126.36,2.27) v1(128.47,25.81) v1(129.36,17.27) v1(129.36,2.27) v1(131.21,25.81) v1(131.55,18.99) v1(132.36,2.27) v1(133.72,16.73) v1(133.96,25.81) v1(135.36,5.27) v1(135.36,2.27) v1(135.89,16.81) v1(136.96,25.81) v1(138.36,8.27) v1(138.36,5.27) v1(138.36,2.27) v1(138.65,18.69) v1(139.32,25.78) v1(141.36,11.27) v1(141.36,8.27) v1(141.36,5.27) v1(141.36,2.27) v1(142.96,25.81) v1(144.36,14.27) v1(144.36,11.27) v1(144.36,8.27) v1(144.36,5.27) v1(144.36,2.27) v1(145.96,25.81) v1(147.42,18.5) v1(147.36,14.27) v1(147.36,11.27) v1(147.36,8.27) v1(147.36,5.27) v1(147.36,2.27) v1(148.96,25.81) v1(150.36,14.27) v1(150.36,11.27) v1(150.36,8.27) v1(150.36,5.27) v1(150.36,2.27)
$K1_5: length 28.7
  Top Layer w0.254: v1(92.2,18.16) 92.2,29.65 K1.5 ; U2.15 86.52,12.82 92.2,12.82 v1(96.78,17.39)
  Bottom Layer w0.254: v1(92.2,18.16) 96.01,18.16 v1(96.78,17.39)
$K1_6: length 25.5
  Top Layer w0.254: K1.6 99.89,25.08 99.31,24.51 96.92,24.51 94.62,22.2 94.62,17.27 91.48,14.13 U2.16
$K2_5: length 29.2
  Top Layer w0.254: 86.47,15.4 86.52,15.36 v1(91.06,15.36) ; K2.5 102.43,17.2 100.59,15.36 v1(96.14,15.36)
  Bottom Layer w0.254: v1(96.14,15.36) v1(91.06,15.36)
$K2_6: length 19.3
  Top Layer w0.254: 113.56,19.91 113.79,19.68 113.79,15.74 113.45,15.4 112.01,15.4 ; 113.56,19.91 113.59,19.91 ; 113.56,19.91 110.45,19.91 110.05,20.31 K2.6
$K3_5: length 19
  Top Layer w0.254: K3.5 115.19,27.11 115.19,15.49 113.84,14.13 U1.5
$K3_6: length 21.5
  Top Layer w0.254: U1.6 114.22,12.86 116.46,15.11 116.46,21.46 120.21,25.2 K3.6
$K4_5: length 25.3
  Top Layer w0.254: K4.5 122.75,25.84 117.98,21.08 117.98,12.93 116.65,11.59 U1.7
$K4_6: length 28.4
  Top Layer w0.254: U1.14 119.97,11.59 119,12.57 119,19.55 123.44,24 129.67,24 130.43,24.76 130.43,29.65 K4.6
$K5_5: length 25.4
  Top Layer w0.254: U1.16 130.09,14.13 132.91,16.95 K5.5
$K5_6: length 30.2
  Top Layer w0.254: K5.6 140.53,22.54 130.85,12.86 U1.15
$K6_5: length 85.2
  Top Layer w0.254: v1(112.4,4.31) 126.37,4.31 143.38,21.33 143.38,25.4 143.54,25.56 143.54,26.05 143.38,26.21 143.38,29.39 K6.5 ; U2.7 82.34,11.59 82.95,10.98 102.19,10.98 v1(103.14,10.03)
  Bottom Layer w0.254: v1(112.4,4.31) 112.4,4.57 110.62,6.34 106.83,6.34 v1(103.14,10.03)
$K6_6: length 86.2
  Top Layer w0.254: v1(107.44,7.11) 107.44,6.85 111.33,2.97 129.46,2.97 143.38,16.89 149.61,16.89 150.69,17.97 K6.6 ; v1(104.14,10.41) 102.53,12.02 89.18,12.02 88.76,11.59 U2.14
  Bottom Layer w0.254: v1(107.44,7.11) v1(104.14,10.41)
$K7_5: length 29
  Top Layer w0.254: U3.16 57.7,14.13 v1(64.52,20.95) ; K7.5 60.14,21.14 v1(60.07,21.08)
  Bottom Layer w0.254: v1(64.52,20.95) 60.2,20.95 v1(60.07,21.08)
$K7_6: length 24.1
  Top Layer w0.254: 51.47,15.4 56.69,15.4 67.76,26.47 K7.6
$K8_5: length 21.7
  Top Layer w0.254: U3.14 49.62,11.59 47.75,13.46 47.75,25.39 49.98,27.62 K8.5
$K8_6: length 25
  Top Layer w0.254: K8.6 57.6,25.84 55.88,24.12 50.29,24.12 49.53,23.36 49.53,13.58 50.25,12.86 U3.15
$K9_5: length 20.5
  Top Layer w0.254: K9.5 39.82,26.86 44.32,22.35 44.32,13.71 43.48,12.86 U3.6
$K9_6: length 21.7
  Top Layer w0.254: K9.6 45.52,27.8 45.52,12.88 44.24,11.59 U3.7
$K10_5: length 24.9
  Top Layer w0.254: v1(30.23,20.44) 29.66,21.01 K10.5 ; v1(34.4,20.44) 34.4,17.92 36.92,15.4 42.01,15.4
  Bottom Layer w0.254: v1(34.4,20.44) v1(30.23,20.44)
$K10_6: length 25.3
  Top Layer w0.254: K10.6 37.28,25.84 32.05,20.61 32.05,18.23 36.15,14.13 U3.5
$K11_5: length 24.5
  Top Layer w0.254: U2.5 77.14,14.01 78.78,14.01 79.5,14.73 79.5,17.27 78.49,18.28 78.49,21.84 75.82,24.51 70.87,24.51 70.3,25.08 K11.5
$K11_6: length 24.9
  Top Layer w0.254: 77.01,15.4 75.57,15.4 75.31,15.15 75.31,13.84 75.69,13.46 79.38,13.46 80.27,14.35 80.27,23.13 77.92,25.48 K11.6
$U1_18: length 49.4
  Top Layer w0.254: U1.18 v1(119.76,16.67) ; v1(93.47,12.82) NOREF#7.TP6 105.92,12.82 v1(108.59,15.49) ; v1(78.61,14.85) 78.61,16.25 78.19,16.67 U2.3
  Bottom Layer w0.254: v1(93.47,12.82) 79.12,12.82 78.61,13.33 v1(78.61,14.85) ; v1(108.59,15.49) 109.77,16.67 v1(119.76,16.67)
$U2_18: length 47.6
  Top Layer w0.254: v1(53.72,12.82) 60.96,12.82 63.63,15.49 NOREF#6.TP7 v1(72.39,15.49) ; U2.18 v1(81.32,16.67) ; 42.01,16.67 v1(43.67,16.67)
  Bottom Layer w0.254: v1(72.39,15.49) 74.3,15.49 75.48,16.67 v1(81.32,16.67) ; v1(53.72,12.82) 47.52,12.82 v1(43.67,16.67)
CLK: length 173.4
  Top Layer w0.254: U1.13 123.15,10.32 124.08,9.39 124.08,7.23 122.37,5.52 110.18,5.52 v1(110.11,5.46) ; 7.84,45.78 3.75,45.78 3.43,45.46 3.43,14.22 8.42,9.23 33.56,9.23 37.72,5.07 46.86,5.07 v1(47.25,5.46) ; v1(101.6,9.77) 89.79,9.77 89.24,10.32 U2.13 86.45,10.3 v1(81.89,10.3) ; v1(47.25,8.63) 48.94,10.32 U3.13 71.46,10.32 v1(72.95,11.81)
  Bottom Layer w0.254: v1(110.11,5.46) 106.43,5.46 102.11,9.77 v1(101.6,9.77) ; v1(72.95,11.81) 80.38,11.81 v1(81.89,10.3) ; v1(47.25,5.46) v1(47.25,8.63)
CT: length 1.9
  Top Layer w0.254: U4.4 19.26,31.08 C6.1
DATA: length 164.4
  Top Layer w0.254: U1.3 111.97,16.63 110.67,16.63 109.35,15.31 109.35,10.03 103.12,3.8 36.13,3.8 32.7,7.23 NOREF#4.TP5 8.51,7.23 2.16,13.58 v1(2.16,21.58) 2.16,49.4 3.62,50.86 7.84,50.86
HI-1: length 216.5
  Top Layer w0.6: CN2.13 211.93,50.82 195.07,67.69 48.26,67.69 31.75,51.18 31.75,35.68 30.86,34.79 K10.3
HI-2: length 204
  Top Layer w0.6: 39.82,34.79 41.02,34.79 41.91,35.68 41.91,48.51 58.8,65.4 189.87,65.4 207.21,48.05 CN2.12
HI-3: length 191.7
  Top Layer w0.6: 49.98,34.79 51.18,34.79 52.07,35.68 52.07,46.22 68.84,62.99 185.17,62.99 202.87,45.28 CN2.11
HI-4: length 179.4
  Top Layer w0.6: CN2.10 199.29,42.51 181.48,60.32 78.23,60.32 62.23,44.32 62.23,35.68 61.34,34.79 60.14,34.79
HI-5: length 167.7
  Top Layer w0.6: 70.3,34.79 71.5,34.79 72.39,35.68 72.39,43.81 86.11,57.53 176.4,57.53 194.19,39.74 CN2.9
HI-6: length 144.8
  Top Layer w0.6: 92.25,34.79 93.46,34.79 94.35,35.68 94.35,44.17 104.9,54.73 172.09,54.73 189.84,36.97 CN2.8
HI-7: length 133.7
  Top Layer w0.6: 102.41,34.79 103.62,34.79 104.51,35.68 104.51,44.3 112.27,52.06 168.02,52.06 185.88,34.2 CN2.7
HI-8: length 122.5
  Top Layer w0.6: CN2.6 181.79,31.43 163.96,49.27 119.38,49.27 114.67,44.56 114.67,35.68 113.78,34.79 112.57,34.79
HI-9: length 109.7
  Top Layer w0.6: CN2.5 176.69,28.67 158.62,46.73 129.92,46.73 124.83,41.63 124.83,35.68 123.94,34.79 122.73,34.79
HI-10: length 98.5
  Top Layer w0.6: CN2.4 171.71,25.89 153.67,43.94 138.18,43.94 135.89,41.65 135.89,35.43 135.26,34.79 K5.3
HI-A: length 172.3
  Top Layer w0.6: K11.4 70.55,32.25 71.82,33.52 80.01,33.52 82.04,35.55 v2(82.04,42.16) ; K6.2 144.34,36.06 151.12,36.06 156.34,30.84 156.34,21.08 161.42,16 CN3.3
  Bottom Layer w0.6: K10.4 30.93,33.52 38.55,33.52 K9.4 40.77,32.25 42.04,33.52 48.71,33.52 K8.4 51.25,33.52 58.87,33.52 K7.4 61.41,33.52 69.03,33.52 K11.4 ; v2(82.04,42.16) 82.13,42.08 144.61,42.08 145.67,41.02 145.67,37.97 145.03,37.33 K6.2
HI-B: length 43.1
  Top Layer w0.6: K6.4 144.27,31.05 151.65,31.05 152.29,30.41 152.29,15.09 161.55,5.84 CN3.1
HI_B_R: length 56.1
  Bottom Layer w0.6: K1.4 93.54,33.52 101.16,33.52 K2.4 103.7,33.52 111.32,33.52 K3.4 113.86,33.52 121.48,33.52 K4.4 124.02,33.52 131.64,33.52 K5.4 134.18,33.52 141.8,33.52 K6.3
ID: length 6.2
  Top Layer w0.254: 13.84,23.49 12.44,23.49 11.87,22.92 NOREF#3.TP3 CN1.20
LO-1: length 214.4
  Top Layer w0.6: K10.8 36.07,34.79 35.18,35.68 35.18,49.14 52.58,66.54 192.79,66.54 209.89,49.44 219.32,49.44
LO-2: length 201.4
  Top Layer w0.6: 47.44,34.79 46.23,34.79 45.34,35.68 45.34,45.84 63.63,64.13 187.71,64.13 205.17,46.67 CN2.24
LO-3: length 189.4
  Top Layer w0.6: 219.32,43.9 201.33,43.9 183.52,61.72 73.03,61.72 55.5,44.19 55.5,35.68 56.39,34.79 57.6,34.79
LO-4: length 176.8
  Top Layer w0.6: CN2.22 196.74,41.13 178.94,58.92 82.68,58.92 65.66,41.9 65.66,35.68 66.55,34.79 67.76,34.79
LO-5: length 165.4
  Top Layer w0.6: 77.92,34.79 76.71,34.79 75.82,35.68 75.82,41.9 90.04,56.13 174.12,56.13 191.89,38.36 219.32,38.36
LO-6: length 142.8
  Top Layer w0.6: 99.87,34.79 98.66,34.79 97.77,35.68 97.77,42.65 108.46,53.33 170.05,53.33 187.8,35.59 CN2.20
LO-7: length 131
  Top Layer w0.6: 110.03,34.79 108.82,34.79 107.93,35.68 107.93,41.76 116.84,50.67 165.86,50.67 183.71,32.82 219.32,32.82
LO-8: length 120.2
  Top Layer w0.6: 120.19,34.79 118.98,34.79 118.09,35.68 118.09,42.52 123.57,48 161.42,48 179.37,30.05 CN2.18
LO-9: length 108.3
  Top Layer w0.6: 130.35,34.79 129.14,34.79 128.25,35.68 128.25,41.13 132.46,45.33 156.34,45.33 174.5,27.17 219.22,27.17 219.32,27.28
LO-10: length 96.4
  Top Layer w0.6: CN2.16 169.54,24.51 151.51,42.54 140.97,42.54 138.3,39.87 138.3,35.55 139.07,34.79 K5.8
LO-A: length 159.5
  Top Layer w0.6: K11.7 84.33,32.25 87.12,35.05 v2(87.12,43.94) ; K6.9 153.42,37.33 159.39,31.36 159.39,23.36 161.67,21.08 CN3.4
  Bottom Layer w0.6: v2(87.12,43.94) 87.5,43.56 145.97,43.56 148.08,41.44 148.08,37.84 148.59,37.33 K6.9 ; K10.7 38.55,30.98 46.17,30.98 K9.7 48.71,30.98 56.33,30.98 K8.7 58.87,30.98 66.49,30.98 K7.7 69.03,30.98 76.65,30.98 K11.7
LO-B: length 31.3
  Top Layer w0.6: K6.7 152.27,32.25 154.31,30.22 154.31,18.41 161.8,10.92 CN3.2
LO_B_R: length 57.1
  Bottom Layer w0.6: K1.7 101.16,30.98 108.78,30.98 K2.7 111.32,30.98 118.94,30.98 K3.7 120.65,32.25 121.92,30.98 129.1,30.98 K4.7 131.64,30.98 139.26,30.98 K5.7 141.8,30.98 145.42,30.98 149.23,34.79 K6.8
NRST: length 21.1
  Top Layer w0.254: U4.3 21.96,32.39 18.73,35.62 NOREF#5.TP1 CN1.25 CN1.9
OE/RST_OUT: length 109.2
  Top Layer w0.254: v1(23.75,22.35) 23.74,22.36 NOREF#2.TP4 R4.1 U4.1 ; v1(106.55,9.01) 104.01,6.47 82.81,6.47 80.22,9.05 U2.9 U2.8 74.97,10.32 70.61,5.96 49.09,5.96 46,9.05 U3.9 U3.8 37.87,10.32 26.04,22.15 v1(26.04,22.35) ; v1(109.47,9.01) 111.97,9.01 U1.9 U1.8
  Bottom Layer w0.254: v1(26.04,22.35) v1(23.75,22.35) ; v1(106.55,9.01) v1(109.47,9.01)
SENSE: length 3.8
  Top Layer w0.254: R2.1 17.03,27.16 R3.2 17.87,28.6 18.18,28.3 U4.5
STROBE: length 145.3
  Top Layer w0.254: v1(47.88,6.22) 39.18,6.22 25.02,20.37 25.02,34.79 NOREF.TP2 19.13,40.68 9.76,40.68 9.74,40.7 CN1.27 CN1.11 ; U1.12 115.53,9.05 113.67,10.92 110.62,10.92 109.98,10.28 v1(109.98,9.9) ; v1(107.82,9.9) 105.03,9.9 103.25,8.12 89.28,8.12 88.35,9.05 U2.12 81.84,9.05 79.94,10.95 73.44,10.95 71.54,9.05 U3.12 48.81,9.05 v1(47.88,8.12)
  Bottom Layer w0.254: v1(47.88,6.22) v1(47.88,8.12) ; v1(107.82,9.9) v1(109.98,9.9)

## Copper pours and planes (outline as drawn; the poured copper is in the pictures)
+5V on Top Layer: 4.03,33.85 4.04,33.96 4.09,34.09 4.18,34.2 4.29,34.29 4.42,34.34 4.53,34.35 15,34.35 15.1,34.34 15.23,34.29 15.35,34.2 15.43,34.09 15.48,33.96 15.5,33.85 15.5,24.75 15.48,24.65 15.43,24.51 15.35,24.4 15.23,24.31 15.1,24.26 15,24.25 4.53,24.25 4.42,24.26 4.29,24.31 4.18,24.4 4.09,24.51 4.04,24.65 4.03,24.75
GND on Top Layer: -0.12,68.61 24.67,68.61 24.67,-0.98 -0.12,-0.98
GND on Top Layer: 0.13,26.19 150.94,26.19 150.94,-7.08 0.13,-7.08
GND on Bottom Layer: 0,25.66 0.01,25.76 0.06,25.9 0.15,26.01 0.26,26.1 0.39,26.15 0.5,26.16 150.36,26.16 150.47,26.15 150.6,26.1 150.71,26.01 150.8,25.9 150.85,25.76 150.86,25.66 150.86,0.32 150.85,0.21 150.8,0.08 150.71,-0.04 150.6,-0.12 150.47,-0.17 150.36,-0.18 0.5,-0.18 0.39,-0.17 0.26,-0.12 0.15,-0.04 0.06,0.08 0.01,0.21 0,0.32
GND on Bottom Layer: -0.25,67.9 -0.24,68.01 -0.19,68.14 -0.11,68.26 0.01,68.34 0.14,68.39 0.25,68.4 24.14,68.4 24.24,68.39 24.37,68.34 24.49,68.26 24.57,68.14 24.62,68.01 24.64,67.9 24.64,-0.52 24.62,-0.63 24.57,-0.76 24.49,-0.88 24.37,-0.96 24.24,-1.01 24.14,-1.02 0.25,-1.02 0.14,-1.01 0.01,-0.96 -0.11,-0.88 -0.19,-0.76 -0.24,-0.63 -0.25,-0.52

Small or netless copper shapes (teardrops, artwork), in the pictures only: 244 on Top Layer, 122 on Bottom Layer

## Text on the board
Bottom Silkscreen Layer: Designed by: / Arwid Vasilev / github.com/arwidcool / PCB Outline By: / Patrick Baus
Top Silkscreen Layer: GND | 5V | ID | L | H | OUT A | OUT B | Low Voltage MAX 90V / Voltage And Resistance / ONLY!!!! | V1.0 | Replacement | Scanner Card | Test Fixture | DB25 | WARNING!!!
